# EAGLE design Dash (EAGLE 8.4.1)
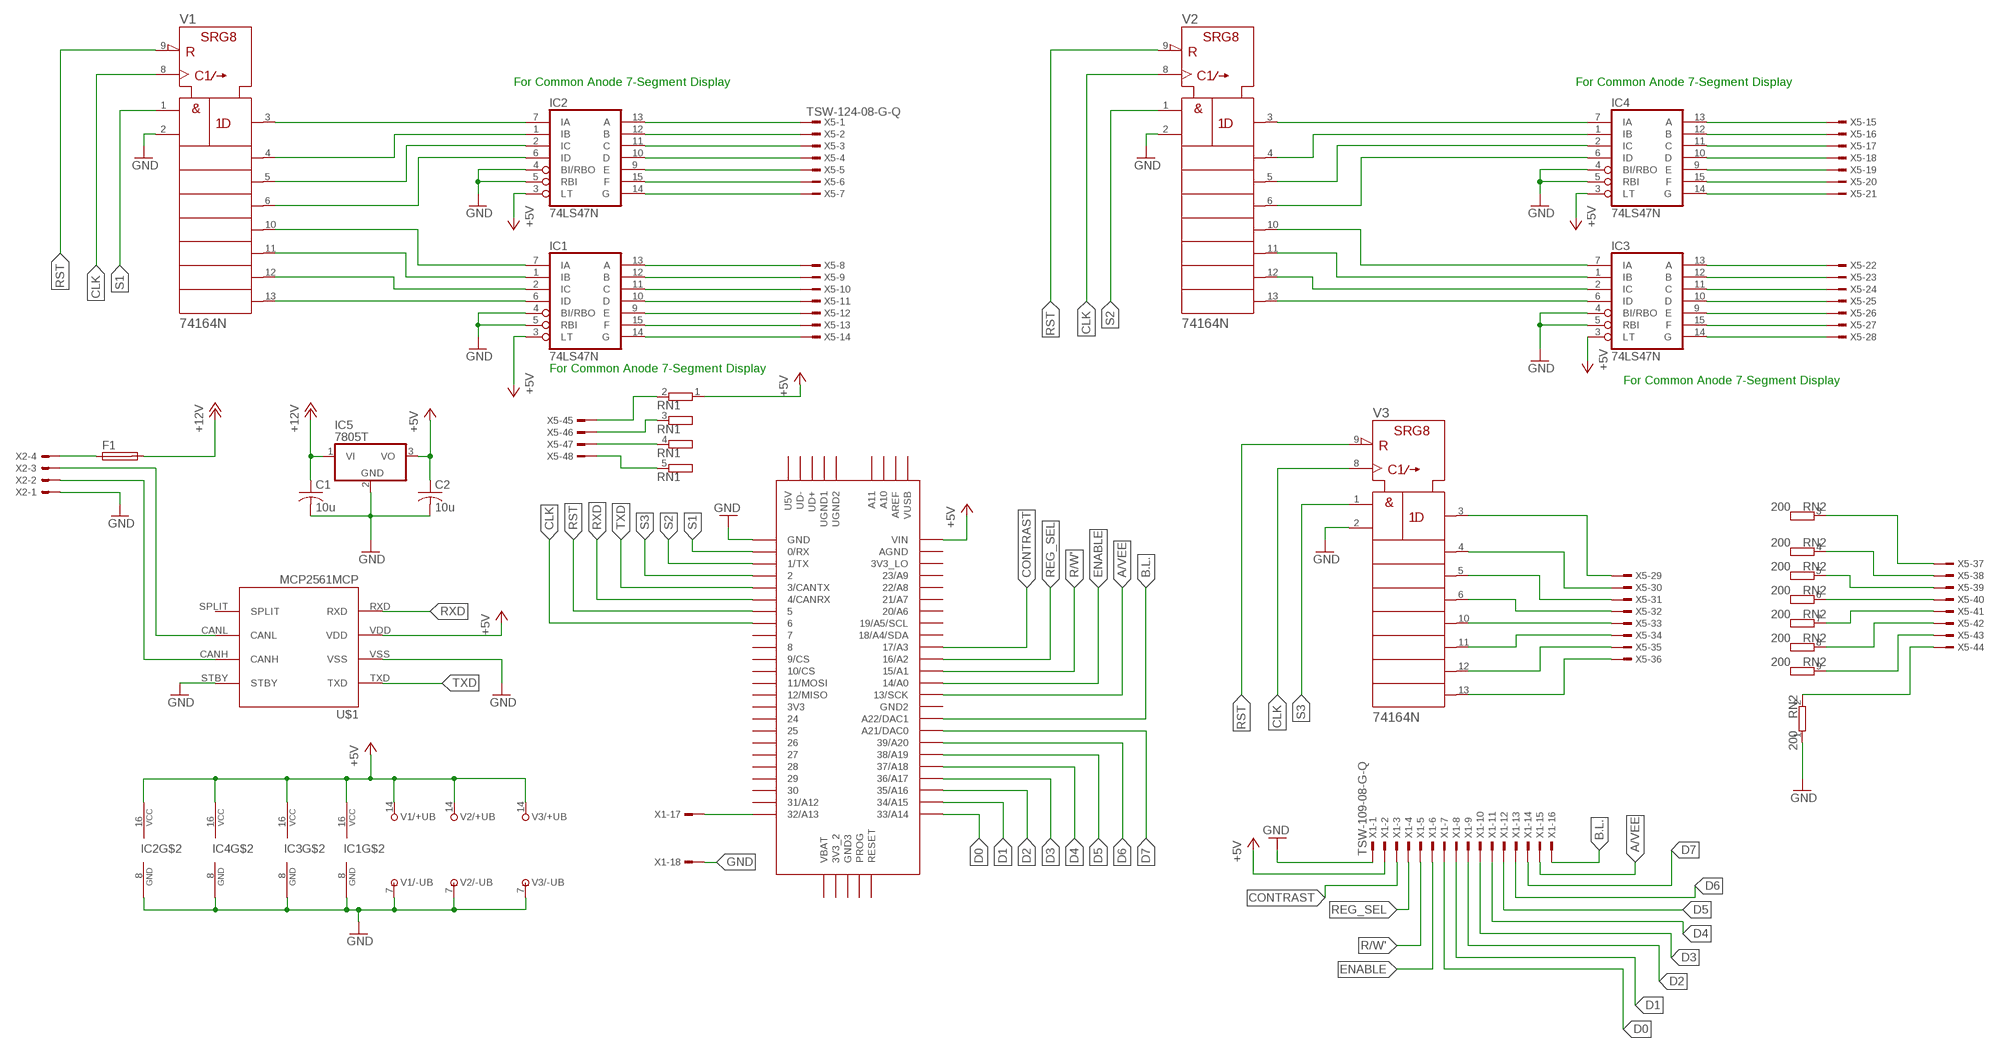
[diagram p0: schematic, sheet 1]

## Parts
C1  10u  C-US050-024X044  [C050-024X044]
C2  10u  C-US050-024X044  [C050-024X044]
F1  FUSEBLANK_5X20MM  [FUSE_HOLDER_5X20MM]
IC1  74LS47N  [DIL16]
IC2  74LS47N  [DIL16]
IC3  74LS47N  [DIL16]
IC4  74LS47N  [DIL16]
IC5  7805T  [TO220H]
RN1  GE04RP  [SIL5]
RN2  200  GE08RP  [SIL9]
U$1  MCP2561MCP  [MCP2561_PDIP]
U$2  TEENSY_3.5/3.6  [TEENSY_3.5/3.6]
V1  74164N  [DIL14]
V2  74164N  [DIL14]
V3  74164N  [DIL14]
X1  TSW-109-08-G-Q  [TSW-109-XX-G-Q]
X2  KK-156-4  [KK-156-4]
X5  TSW-124-08-G-Q  [TSW-124-XX-G-Q]

## Nets
+5V: C2.1 IC1.3(LT) IC1.16(VCC) IC2.3(LT) IC2.16(VCC) IC3.3(LT) IC3.16(VCC) IC4.3(LT) IC4.16(VCC) IC5.3(VO) RN1.1 U$1.VDD U$2.VIN V1.14(+UB) V2.14(+UB) V3.14(+UB) X1.2
+12V: C1.1 F1.2 IC5.1(VI)
A1: IC2.13(A) X5.1
A2: IC1.13(A) X5.8
A3: IC3.13(A) X5.22
A4: IC4.13(A) X5.15
A/VEE: U$2.13/SCK X1.15
B1: IC2.12(B) X5.2
B2: IC1.12(B) X5.9
B3: IC3.12(B) X5.23
B4: IC4.12(B) X5.16
B.L.: U$2.A22/DAC1 X1.16
C1: IC2.11(C) X5.3
C2: IC1.11(C) X5.10
C3: IC3.11(C) X5.24
C4: IC4.11(C) X5.17
CAN_H: U$1.CANH X2.2
CAN_L: U$1.CANL X2.3
CLK: U$2.6 V1.8(CLK) V2.8(CLK) V3.8(CLK)
CONTRAST: U$2.17/A3 X1.3
D0: U$2.33/A14 X1.7
D1: IC2.10(D) U$2.34/A15 X1.8 X5.4
D2: IC1.10(D) U$2.35/A16 X1.9 X5.11
D3: IC3.10(D) U$2.36/A17 X1.10 X5.25
D4: IC4.10(D) U$2.37/A18 X1.11 X5.18
D5: U$2.38/A19 X1.12
D6: U$2.39/A20 X1.13
D7: U$2.21/DAC0(A21/DAC0) X1.14
E1: IC2.9(E) X5.5
E2: IC1.9(E) X5.12
E3: IC3.9(E) X5.26
E4: IC4.9(E) X5.19
ENABLE: U$2.14/A0 X1.6
F1: IC2.15(F) X5.6
F2: IC1.15(F) X5.13
F3: IC3.15(F) X5.27
F4: IC4.15(F) X5.20
G1: IC2.14(G) X5.7
G2: IC1.14(G) X5.14
G3: IC3.14(G) X5.28
G4: IC4.14(G) X5.21
GND: C1.2 C2.2 IC1.4(BI/RBO) IC1.5(RBI) IC1.8(GND) IC2.4(BI/RBO) IC2.5(RBI) IC2.8(GND) IC3.4(BI/RBO) IC3.5(RBI) IC3.8(GND) IC4.4(BI/RBO) IC4.5(RBI) IC4.8(GND) IC5.2(GND) RN2.1 U$1.STBY U$1.VSS U$2.GND V1.2(B) V1.7(-UB) V2.2(B) V2.7(-UB) V3.2(B) V3.7(-UB) X1.1 X1.18 X2.1
N$1: RN2.6 X5.40
N$2: V3.4(QB) X5.30
N$3: V3.5(QC) X5.31
N$4: V3.6(QD) X5.32
N$7: V3.10(QE) X5.33
N$8: V3.11(QF) X5.34
N$9: V3.12(QG) X5.35
N$10: V3.13(QH) X5.36
N$11: RN2.5 X5.39
N$12: RN2.4 X5.38
N$13: RN2.3 X5.37
N$14: RN2.7 X5.41
N$15: RN2.8 X5.42
N$16: RN2.9 X5.43
N$17: RN2.2 X5.44
N$18: U$2.32/A13 X1.17
N$19: F1.1 X2.4
N$20: RN1.2 X5.45
N$21: RN1.3 X5.46
N$22: RN1.4 X5.47
N$23: RN1.5 X5.48
N$31: IC4.7(IA) V2.3(QA)
N$32: IC4.1(IB) V2.4(QB)
N$33: IC4.2(IC) V2.5(QC)
N$34: IC4.6(ID) V2.6(QD)
N$35: IC3.7(IA) V2.10(QE)
N$37: IC3.2(IC) V2.12(QG)
N$38: IC3.6(ID) V2.13(QH)
N$39: IC2.7(IA) V1.3(QA)
N$40: IC2.1(IB) V1.4(QB)
N$41: IC2.2(IC) V1.5(QC)
N$42: IC2.6(ID) V1.6(QD)
N$43: IC1.7(IA) V1.10(QE)
N$44: IC1.1(IB) V1.11(QF)
N$45: IC1.2(IC) V1.12(QG)
N$46: IC1.6(ID) V1.13(QH)
N$47: IC3.1(IB) V2.11(QF)
N$56: V3.3(QA) X5.29
R/W': U$2.15/A1 X1.5
REG_SEL: U$2.16/A2 X1.4
RST: U$2.5 V1.9(!CLR) V2.9(!CLR) V3.9(!CLR)
RXD: U$1.RXD U$2.4/CANRX
S1: U$2.0/RX V1.1(A)
S2: U$2.1/TX V2.1(A)
S3: U$2.2 V3.1(A)
TXD: U$1.TXD U$2.3/CANTX
Unconnected: U$1.SPLIT U$2.3V3 U$2.3V3_2 U$2.3V3_LO U$2.7 U$2.8 U$2.9/CS U$2.10/CS U$2.11/MOSI U$2.12/MISO U$2.18/A4/SDA U$2.19/A5/SCL U$2.20/A6 U$2.21/A7 U$2.22/A8 U$2.23/A9 U$2.24 U$2.25 U$2.26 U$2.27 U$2.28 U$2.29 U$2.30 U$2.31/A12 U$2.A10 U$2.A11 U$2.AGND U$2.AREF U$2.GND2 U$2.GND3 U$2.PROG U$2.RESET U$2.U5V U$2.UD+ U$2.UD- U$2.UGND1 U$2.UGND2 U$2.VBAT U$2.VUSB

## Notes on the sheet
- For Common Anode 7-Segment Display | For Common Anode 7-Segment Display
- For Common Anode 7-Segment Display
- For Common Anode 7-Segment Display

## Library data of the parts
C1 C2 = rcl:C-US: CAPACITOR, American symbol; CAPACITANCE: 10uF
F1 = fuse:FUSE: Fuse; OC_FARNELL: unknown; OC_NEWARK: unknown
IC1-IC4 = 74xx-us:74*47: BCD to seven segment DECODER/DRIVER Source: http://www.ee.washington.edu/stores/DataSheets/74ls/74ls47.pdf
IC5 = linear:78*: Positive VOLTAGE REGULATOR Source: http://cache.national.com/ds/LM/LM78L05.pdf http://www.fairchildsemi.com/ds/LM/LM7805.pdf
RN1 = resistor-sil:GE04RP: SIL RESISTOR; OC_FARNELL: unknown; OC_NEWARK: unknown
RN2 = resistor-sil:GE08RP: SIL RESISTOR; OC_FARNELL: unknown; OC_NEWARK: unknown
U$1 = PoJD:MCP2561: High-Speed CAN Transceiver See http://ww1.microchip.com/downloads/en/DeviceDoc/25167A.pdf The MCP2561/2 is a Microchip Technology Inc. second generation high-speed CAN transceiver. It serves as an interface between a CAN protocol controller and the physical two-wire CAN bus. The device meets the automotive requirements for high-speed (up to 1 Mb/s), low quiescent current, electromagnetic compatibility (EMC) and electrostatic discharge (ESD).
U$2 = Teensy356:TEENSY_3.5/3.6
V1-V3 = 74ttl-din:74*164: 8-bit parallel out SHIFT REGISTER
X1 = con-samtec:TSW-109-*-G: THROUGH-HOLE .025" SQ POST HEADER Source: Samtec TSW.pdf; MF: Samtec Inc.; MPN: TSW-109-07-G-Q
X2 = con-molex:KK-156-4: KK 156 HEADER Source: http://www.molex.com/pdm_docs/sd/026604100_sd.pdf; MF: MOLEX; OC_FARNELL: unknown; OC_NEWARK: unknown
X5 = con-samtec:TSW-124-*-G: THROUGH-HOLE .025" SQ POST HEADER Source: Samtec TSW.pdf; MF: Samtec Inc.; MPN: TSW-124-07-G-Q

## Board
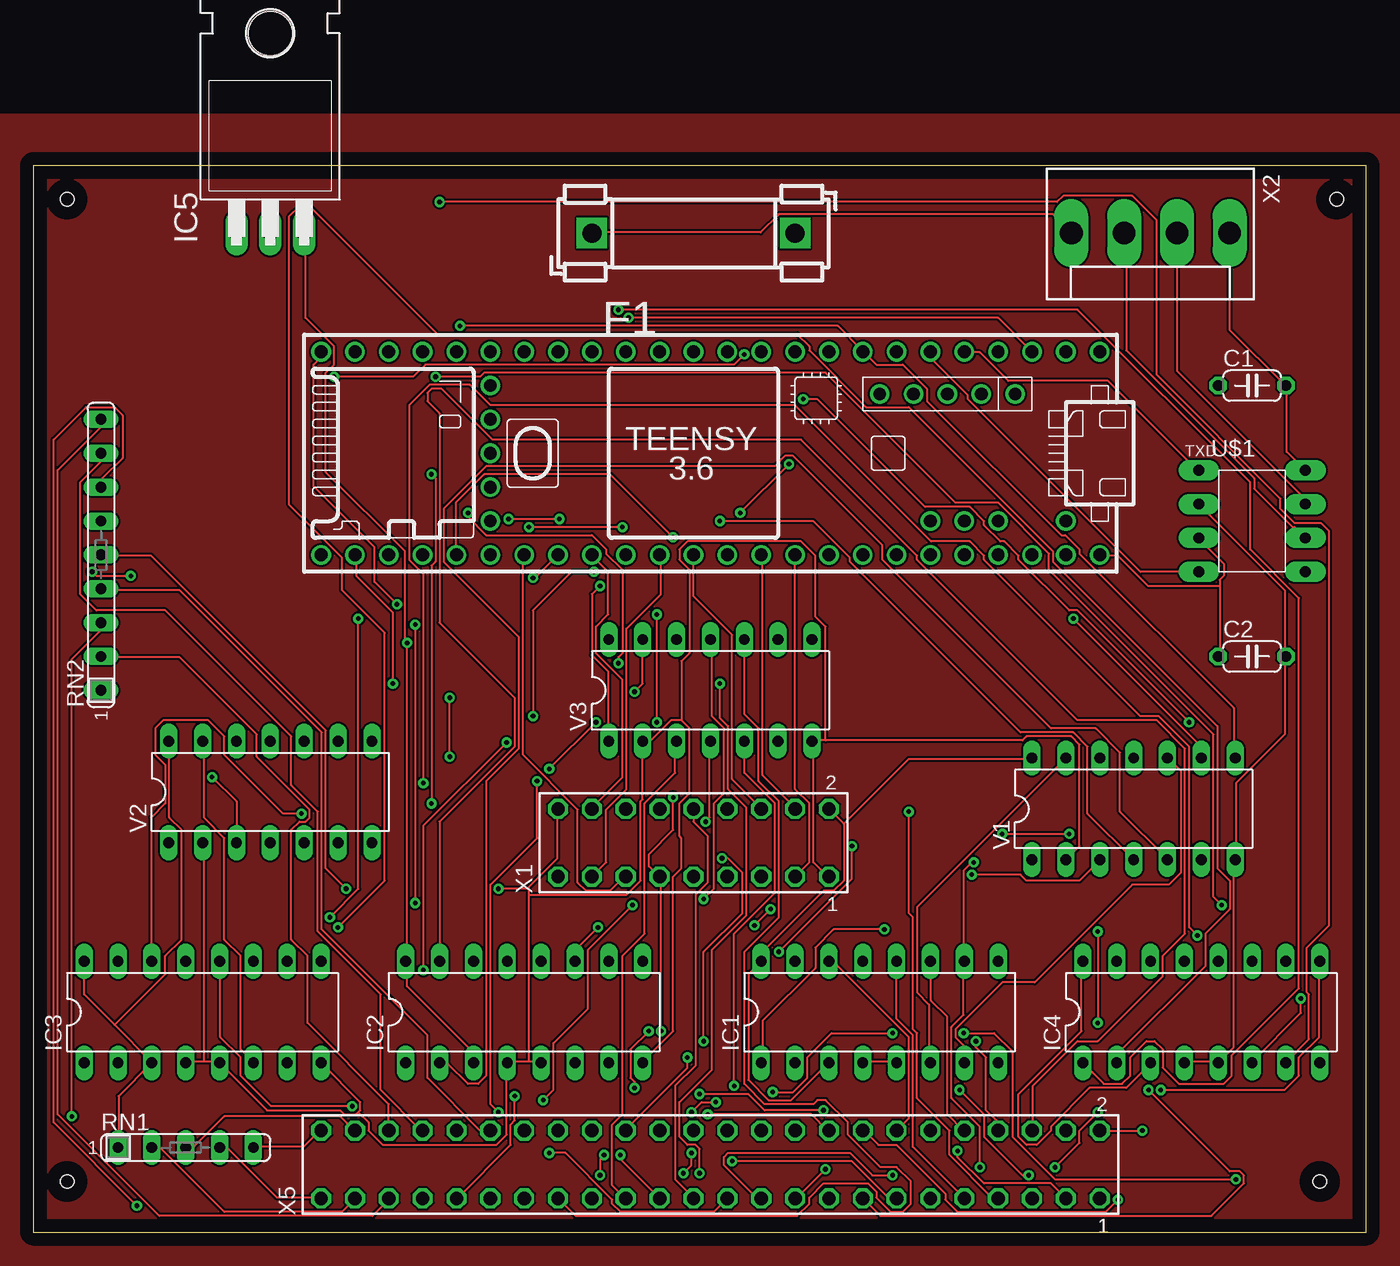
[diagram p1: board, top side]
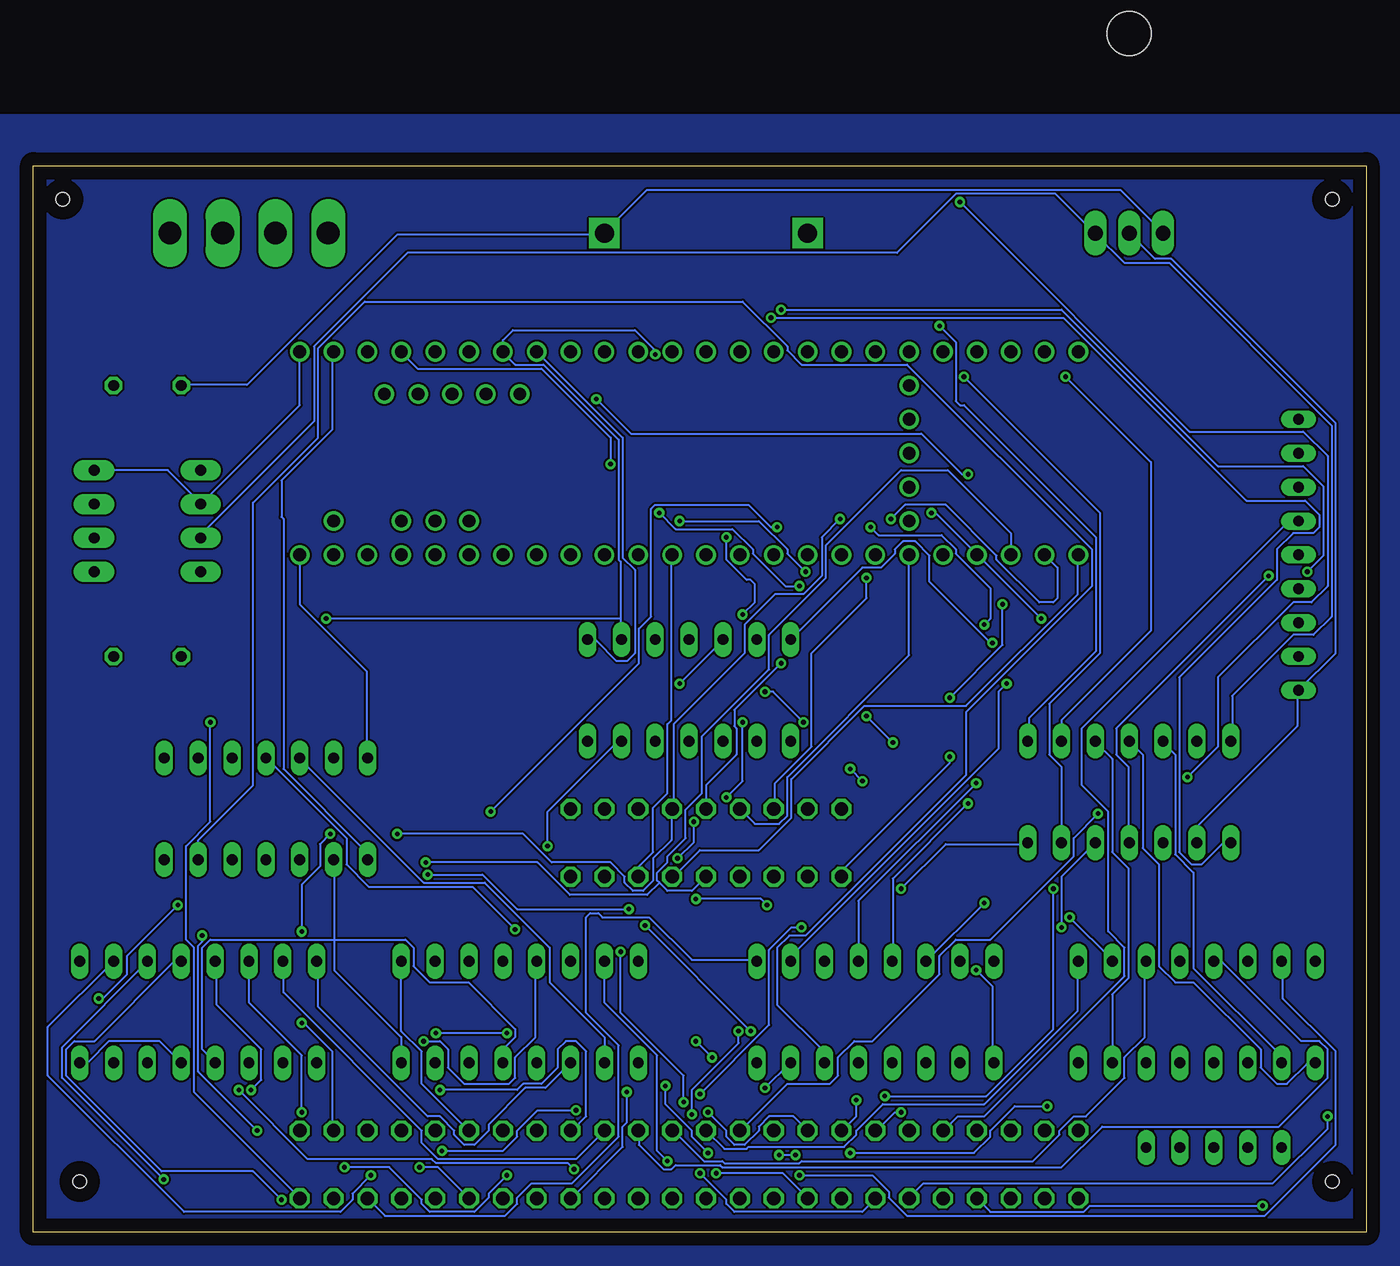
[diagram p2: board, bottom side, seen from below]

Size 100 x 80 mm. Coordinates in mm from the lower left corner, seen from the top.
Outline: 0,0 100,0 100,80 0,80 0,0
Copper layers (1*16): Top 0.035mm / dielectric 1.5mm / Bottom 0.035mm
Design rules "default": minimum track width 6mil, minimum drill 0.35mm, track to track 6mil, track to pad 6mil, pad to pad 6mil, via to via 6mil, smd to smd 6mil, copper to edge 40mil, drill to drill 6mil, minimum pad ring 10mil, minimum via ring 8mil, stop-mask expansion 4mil, vias tented up to drill 0mil, thermal gap 10mil
Holes 1 mm at 2.54,77.47 2.54,3.81 96.52,3.81 97.79,77.47

### Footprints (pad centres in the part's own frame; a part is rotated, then mirrored left to right if it is on the bottom)
C050-024X044 = drill 0.813 octagon: 1 -2.54,0; 2 2.54,0
FUSE_HOLDER_5X20MM = drill 1.422 pad 2.286 square: 1 0,0; 2 15.24,0
DIL16 = drill 0.813 long: 1 -8.89,-3.81; 2 -6.35,-3.81; 3 -3.81,-3.81; 4 -1.27,-3.81; 5 1.27,-3.81; 6 3.81,-3.81; 7 6.35,-3.81; 8 8.89,-3.81; 9 8.89,3.81; 10 6.35,3.81; 11 3.81,3.81; 12 1.27,3.81; 13 -1.27,3.81; 14 -3.81,3.81; 15 -6.35,3.81; 16 -8.89,3.81
TO220H = drill 1.118 long: 1 -2.54,-10.16; 2 0,-10.16; 3 2.54,-10.16 | hole 3.302: 0,4.826
SIL5 = drill 0.813 long: 1 -5.08,0; 2 -2.54,0; 3 0,0; 4 2.54,0; 5 5.08,0
SIL9 = drill 0.813 long: 1 -10.16,0; 2 -7.62,0; 3 -5.08,0; 4 -2.54,0; 5 0,0; 6 2.54,0; 7 5.08,0; 8 7.62,0; 9 10.16,0
MCP2561_PDIP = drill 0.813 pad 1.524 long: CANH 4,1.27; CANL 4,-1.27; RXD -4,-3.81; SPLIT 4,-3.81; STBY 4,3.81; TXD -4,3.81; VDD -4,-1.27; VSS -4,1.27
TEENSY_3.5/3.6 = drill 0.965: 0/RX -25.4,-7.62; 1/TX -22.86,-7.62; 2 -20.32,-7.62; 3/CANTX -17.78,-7.62; 3V3 7.62,-7.62; 3V3_2 17.78,-2.54; 3V3_LO -22.86,7.62; 4/CANRX -15.24,-7.62; 5 -12.7,-7.62; 6 -10.16,-7.62; 7 -7.62,-7.62; 8 -5.08,-7.62; 9/CS -2.54,-7.62; 10/CS 0,-7.62; 11/MOSI 2.54,-7.62; 12/MISO 5.08,-7.62; 13/SCK 5.08,7.62; 14/A0 2.54,7.62; 15/A1 0,7.62; 16/A2 -2.54,7.62; 17/A3 -5.08,7.62; 18/A4/SDA -7.62,7.62; 19/A5/SCL -10.16,7.62; 20/A6 -12.7,7.62; 21/A7 -15.24,7.62; 21/DAC0 12.7,7.62; 22/A8 -17.78,7.62; 23/A9 -20.32,7.62; 24 10.16,-7.62; 25 12.7,-7.62; 26 15.24,-7.62; 27 17.78,-7.62; 28 20.32,-7.62; 29 22.86,-7.62; 30 25.4,-7.62; 31/A12 27.94,-7.62; 32/A13 30.48,-7.62; 33/A14 30.48,7.62; 34/A15 27.94,7.62; 35/A16 25.4,7.62; 36/A17 22.86,7.62; 37/A18 20.32,7.62; 38/A19 17.78,7.62; 39/A20 15.24,7.62; A10 -17.78,5.08; A11 -15.24,5.08; A22/DAC1 10.16,7.62; AGND -25.4,7.62; AREF -20.32,5.08; GND -27.94,-7.62; GND2 7.62,7.62; GND3 17.78,0; PROG 17.78,2.54; RESET 17.78,5.08; U5V -21.59,-4.445; UD+ -16.51,-4.445; UD- -19.05,-4.445; UGND1 -13.97,-4.445; UGND2 -11.43,-4.445; VBAT 17.78,-5.08; VIN -27.94,7.62; VUSB -25.4,5.08
DIL14 = drill 0.813 long: 1 -7.62,-3.81; 2 -5.08,-3.81; 3 -2.54,-3.81; 4 0,-3.81; 5 2.54,-3.81; 6 5.08,-3.81; 7 7.62,-3.81; 8 7.62,3.81; 9 5.08,3.81; 10 2.54,3.81; 11 0,3.81; 12 -2.54,3.81; 13 -5.08,3.81; 14 -7.62,3.81
TSW-109-XX-G-Q = drill 1 pad 1.5 octagon: 1 10.16,-2.54; 2 10.16,2.54; 3 7.62,-2.54; 4 7.62,2.54; 5 5.08,-2.54; 6 5.08,2.54; 7 2.54,-2.54; 8 2.54,2.54; 9 0,-2.54; 10 0,2.54; 11 -2.54,-2.54; 12 -2.54,2.54; 13 -5.08,-2.54; 14 -5.08,2.54; 15 -7.62,-2.54; 16 -7.62,2.54; 17 -10.16,-2.54; 18 -10.16,2.54
KK-156-4 = drill 1.7 pad 2.184 long: 1 -5.94,0; 2 -1.98,0; 3 1.98,0; 4 5.94,0
TSW-124-XX-G-Q = drill 1 pad 1.5 octagon: 1 29.21,-2.54; 2 29.21,2.54; 3 26.67,-2.54; 4 26.67,2.54; 5 24.13,-2.54; 6 24.13,2.54; 7 21.59,-2.54; 8 21.59,2.54; 9 19.05,-2.54; 10 19.05,2.54; 11 16.51,-2.54; 12 16.51,2.54; 13 13.97,-2.54; 14 13.97,2.54; 15 11.43,-2.54; 16 11.43,2.54; 17 8.89,-2.54; 18 8.89,2.54; 19 6.35,-2.54; 20 6.35,2.54; 21 3.81,-2.54; 22 3.81,2.54; 23 1.27,-2.54; 24 1.27,2.54; 25 -1.27,-2.54; 26 -1.27,2.54; 27 -3.81,-2.54; 28 -3.81,2.54; 29 -6.35,-2.54; 30 -6.35,2.54; 31 -8.89,-2.54; 32 -8.89,2.54; 33 -11.43,-2.54; 34 -11.43,2.54; 35 -13.97,-2.54; 36 -13.97,2.54; 37 -16.51,-2.54; 38 -16.51,2.54; 39 -19.05,-2.54; 40 -19.05,2.54; 41 -21.59,-2.54; 42 -21.59,2.54; 43 -24.13,-2.54; 44 -24.13,2.54; 45 -26.67,-2.54; 46 -26.67,2.54; 47 -29.21,-2.54; 48 -29.21,2.54

### Placement (x,y rotation side)
C1  91.44,63.5 0 top
C2  91.44,43.18 0 top
F1  41.91,74.93 0 top
IC1  63.5,16.51 0 top
IC2  36.83,16.51 0 top
IC3  12.7,16.51 0 top
IC4  87.63,16.51 0 top
IC5  17.78,85.09 0 top
RN1  11.43,6.35 0 top
RN2  5.08,50.8 90 top
U$1  91.44,53.34 0 top
U$2  52.07,58.42 180 top
V1  82.55,31.75 0 top
V2  17.78,33.02 0 top
V3  50.8,40.64 0 top
X1  49.53,29.21 0 top
X2  83.82,74.93 180 top
X5  50.8,5.08 0 top

### Tracks (layer width: path | path; a pad name or v marks a point on that pad's centre or on a via)
+5V  (via drill 0.35)
  Top 0.152: IC2.3 32.92,12.8 32.92,13.56 28.04,18.44 28.04,20.27 IC2.16 28.04,20.42 v28.04,44.2 27.89,44.35 27.89,51.05 21.95,57 21.95,64.47 22.55,65.08 22.55,66.45 20.42,68.58 20.42,74.83 IC5.3 | IC4.16 78.64,20.27 78.64,15.09 73.91,10.36 73.91,7.16 74.52,6.55 75.29,6.55 76.35,7.62 76.35,7.92 79.25,10.82 81.99,10.82 83.82,12.65 IC4.3 | 60.81,30.63 60.81,26.36 60.05,25.6 59.28,25.6 54.71,21.03 54.71,20.42 IC1.16 53.65,19.36 53.65,11.43 55.17,9.91 56.84,9.91 59.59,12.65 IC1.3 | X1.2 60.81,30.63 | 60.81,30.63 65.68,35.51 74.83,35.51 V1.14 | 89,48.46 89,48.92 89.31,49.23 89.31,50.14 87.48,51.97 U$1.VDD | 89,48.46 89,43.28 C2.1 | 89,48.46 83.67,48.46 81.38,50.75 80.01,50.75 U$2.VIN | RN1.1 6.4,6.4 6.4,10.21 IC3.3 8.84,12.8 6.1,15.54 | IC3.16 3.81,17.83 6.1,15.54 | 6.1,15.54 9.91,19.36 9.91,20.73 11.12,21.95 11.12,30.18 10.21,31.09 10.21,36.73 V2.14
  Bottom 0.152: IC1.3 61.57,10.82 63.09,10.82 65.84,8.08 65.84,7.62 66.9,6.55 67.67,6.55 68.43,7.32 68.43,7.62 69.49,8.69 70.41,8.69 78.64,16.92 78.64,20.27 IC4.16 | U$2.VIN 80.01,47.09 74.98,42.06 74.98,35.66 V1.14 | V3.14 37.8,49.84 36.42,49.84 35.36,50.9 35.36,51.21 34.75,51.82 33.83,51.82 32.77,50.75 32.77,48.77 28.19,44.2 v28.04,44.2 | V2.14 10.06,36.88 10.06,40.23 5.49,44.81 3.96,44.81 2.59,46.18 2.59,60.5 14.78,72.69 18.14,72.69 20.27,74.83 IC5.3 20.42,74.98 23.32,77.88 30.79,77.88 35.2,73.46 71.93,73.46 78.94,66.45 78.94,60.81 87.33,52.43 87.33,52.12 U$1.VDD
+12V
  Bottom 0.152: C1.1 88.85,63.55 83.97,63.55 72.69,74.83 57.15,74.83 F1.2 57.15,74.98 53.95,78.18 18.44,78.18 15.24,74.98 IC5.1
A1  (via drill 0.35)
  Top 0.152: v29.87,32.16 29.87,49.99 30.18,50.29 30.18,56.54 v29.87,56.84 | v57.76,62.48 58.83,62.48 66.9,54.41 70.26,54.41 71.32,53.34 71.32,53.03 72.54,51.82 72.85,51.82 73.91,50.75 73.91,50.44 77.72,46.63 78.33,46.63 v86.72,38.25
  Bottom 0.152: v29.87,32.16 35.51,26.52 35.51,20.42 IC2.13 | v29.87,56.84 30.33,56.84 33.38,59.89 55.17,59.89 v57.76,62.48 | v86.72,38.25 86.72,30.79 88.54,28.96 88.54,21.95 87.94,21.34 87.94,10.52 80.01,2.59 X5.1
A2  (via drill 0.35)
  Top 0.152: v70.71,14.33 70.71,13.87 71.48,13.11 71.48,9.14 72.39,8.23 X5.8
  Bottom 0.152: v70.71,14.33 69.49,14.33 68.89,13.72 68.89,12.34 67.67,11.12 64.31,11.12 63.86,11.58 63.86,13.11 62.33,14.63 62.33,20.27 IC1.13
A3
  Bottom 0.152: IC3.13 11.43,20.27 10.82,20.27 4.88,14.33 3.5,14.33 2.9,13.72 2.9,11.58 6.55,7.92 19.81,7.92 22.86,4.88 48.31,4.88 48.46,5.03 51.82,5.03 52.12,4.72 52.73,4.72 54.56,6.55 54.56,7.62 X5.22
A4  (via drill 0.35)
  Top 0.152: v83.67,10.67 89.76,4.57 90.53,4.57 90.83,4.27 90.83,3.66 88.39,1.22 63.55,1.22 X5.15
  Bottom 0.152: v83.67,10.67 82.91,11.43 82.91,13.72 86.26,17.07 86.26,20.27 IC4.13
A/VEE
  Top 0.152: X1.15 42.98,27.74 42.98,31.7 44.5,33.22 44.5,45.26 47.09,47.85 47.09,50.75 U$2.13/SCK
B1  (via drill 0.35)
  Top 0.152: v29.26,33.68 29.26,49.38 28.19,50.44 28.19,62.03 29.72,63.55 32.77,63.55 34.29,62.03 57.15,62.03 67.36,51.82 70.26,51.82 71.32,50.75 71.32,50.44 83.06,38.71 84.43,38.71 86.72,36.42 86.72,22.86 v87.33,22.25 | X5.2 v83.21,7.62
  Bottom 0.152: IC2.12 38.1,24.84 v29.26,33.68 | v87.33,22.25 87.33,21.79 87.63,21.49 87.63,12.04 v83.21,7.62
B2
  Top 0.152: IC1.12 64.77,16 65.99,14.78 65.99,6.4 X5.9
B3  (via drill 0.35)
  Top 0.152: v23.93,9.45 17.83,9.45 15.54,11.73 15.54,13.11 14.02,14.63 14.02,20.27 IC3.12 | v38.71,5.94 39.93,5.94 43.43,2.44 43.43,2.13 44.04,1.52 51.05,1.52 X5.23
  Bottom 0.152: v23.93,9.45 26.36,9.45 28.19,7.62 28.19,7.16 29.41,5.94 v38.71,5.94
B4  (via drill 0.35)
  Top 0.152: v81.38,2.44 80.47,1.52 69.34,1.52 68.43,2.44 68.43,2.9 64.77,6.55 63.4,6.55 62.33,7.62 X5.16
  Bottom 0.152: v81.38,2.44 83.52,4.57 90.37,4.57 97.54,11.73 97.54,13.72 96.93,14.33 95.4,14.33 89.46,20.27 89,20.27 IC4.12
B.L.
  Top 0.152: U$2.A22/DAC1 41.91,50.75 43.13,49.53 43.13,46.33 42.22,45.41 42.22,43.43 44.2,41.45 44.2,34.14 41.91,31.85 X1.16
C1  (via drill 0.35)
  Top 0.152: v42.37,22.86 40.69,21.18 40.69,20.42 IC2.11 | v49.99,10.36 53.65,10.36 54.86,9.14 v59.28,9.14 | v69.34,6.1 69.34,5.64 71.32,3.66 76.35,3.66 X5.3
  Bottom 0.152: v42.37,22.86 43.13,22.86 44.81,21.18 44.81,15.54 v49.99,10.36 | v59.28,9.14 62.18,9.14 63.7,7.62 63.7,7.16 64.77,6.1 v69.34,6.1
C2
  Top 0.152: IC1.11 67.36,20.27 67.36,17.37 68.58,16.15 68.58,8.84 69.8,7.62 X5.10
C3
  Bottom 0.152: IC3.11 16.61,20.27 16.61,14.63 18.14,13.11 18.14,11.58 21.03,8.69 21.95,8.69 23.01,7.62 23.01,7.32 24.99,5.33 42.37,5.33 42.52,5.18 48.16,5.18 48.31,5.33 49.68,5.33 51.97,7.62 X5.24
C4  (via drill 0.35)
  Top 0.152: v90.22,3.96 76.66,3.96 73.46,7.16 73.46,13.56 72.08,14.94 v69.8,14.94 | v64.47,14.94 59.89,14.94 58.06,13.11 58.06,11.58 57,10.52 v55.47,10.52
  Bottom 0.152: v90.22,3.96 97.84,11.58 97.84,13.87 91.44,20.27 IC4.11 | v64.47,14.94 v69.8,14.94 | v55.47,10.52 55.47,8.23 55.78,7.92 55.78,6.4 59.59,2.59 X5.17
CAN_H
  Top 0.152: U$1.CANH 95.4,54.71 95.4,55.02 85.8,64.62 85.8,74.83 X2.2
CAN_L
  Top 0.152: U$1.CANL 95.4,52.12 94.64,52.88 94.49,52.88 91.59,55.78 91.59,56.54 81.99,66.14 81.99,74.83 X2.3
CLK  (via drill 0.35)
  Top 0.152: v32,67.97 60.35,67.97 62.18,66.14 U$2.6 62.33,65.99 63.25,65.08 65.23,65.08 67.06,63.25 67.06,62.33 77.11,52.27 77.42,52.27 78.49,51.21 78.49,50.9 90.07,39.32 90.07,35.66 V1.8
  Bottom 0.152: v32,67.97 30.79,66.75 30.79,62.33 30.48,62.03 30.18,62.03 20.27,52.12 20.27,43.59 25.3,38.56 25.3,36.88 V2.8 | U$2.6 55.78,59.59 55.78,50.6 54.86,49.68 54.86,43.43 55.47,42.82 56.24,42.82 57.76,44.35 58.37,44.35 V3.8
CONTRAST
  Top 0.152: U$2.17/A3 57.15,33.22 58.22,32.16 58.22,27.74 X1.3
D0
  Bottom 0.152: U$2.33/A14 21.64,50.75 21.64,47.85 30.02,39.47 37.64,39.47 43.13,33.98 43.13,31.09 45.57,28.65 49.99,28.65 51.97,26.67 X1.7
D1  (via drill 0.35)
  Top 0.152: v26.98,41.15 26.98,46.48 24.23,49.23 24.23,50.75 U$2.34/A15 | v35.66,53.49 v39.47,53.49 | v79.86,22.55 v79.86,15.7 | v72.69,29.87 v77.72,29.87
  Bottom 0.152: v26.98,41.15 27.58,40.54 27.58,36.27 43.13,20.73 43.13,20.42 IC2.10 | v39.47,53.49 40.84,52.12 40.84,49.23 42.22,47.85 44.35,47.85 46.63,45.57 46.63,43.43 51.97,38.1 51.97,31.85 X1.8 52.12,31.7 52.12,29.41 53.49,28.04 53.49,26.36 54.25,25.6 55.02,25.6 55.63,26.21 55.63,26.67 56.69,27.74 61.11,27.74 63.25,29.87 v72.69,29.87 | v35.66,53.49 34.59,54.56 31.55,54.56 27.74,50.75 27.74,50.44 24.54,47.24 23.47,47.24 23.16,47.55 23.16,49.84 U$2.34/A15 | v79.86,15.7 79.7,15.7 77.57,13.56 77.57,7.62 X5.4 | v79.86,22.55 79.86,26.06 78.49,27.43 78.49,29.11 v77.72,29.87
D2  (via drill 0.35)
  Top 0.152: v71.02,4.88 71.02,7.92 68.89,10.06 68.89,15.39 69.8,16.31 69.8,20.27 IC1.10 69.8,20.42 69.8,27.13 70.41,27.74 v70.56,27.74
  Bottom 0.152: v71.02,4.88 69.65,4.88 X5.11 | U$2.35/A16 26.67,52.43 31.39,57.15 34.9,57.15 40.54,51.51 40.54,49.07 44.81,44.81 44.81,42.22 49.84,37.19 49.84,32.92 51.05,31.7 51.05,29.57 52.43,28.19 52.43,27.74 53.19,26.98 53.19,26.36 53.03,26.21 | 53.03,26.21 52.43,25.6 50.6,25.6 X1.9 | v70.56,27.74 62.18,27.74 59.74,25.3 53.95,25.3 53.03,26.21
D3  (via drill 0.35)
  Top 0.152: v24.38,46.02 24.38,25.76 v22.25,23.62 | v43.89,42.67 43.89,43.13 44.2,43.43 44.2,49.68 42.98,50.9 42.98,51.21 41.91,52.27 33.98,52.27 32.61,53.65 v32.61,53.95 | X1.10 49.53,30.79 50.6,29.72 50.6,26.21 49.68,25.3 49.68,12.5 48.16,10.97 48.16,3.96 49.53,2.59 X5.25
  Bottom 0.152: v24.38,46.02 29.11,50.75 U$2.36/A17 29.26,50.9 32.31,53.95 v32.61,53.95 | v22.25,23.62 19.05,20.42 IC3.10 | X1.10 49.53,33.53 47.24,35.81 47.24,37.8 47.4,37.95 47.4,39.17 v43.89,42.67
D4  (via drill 0.35)
  Top 0.152: v48.01,52.12 43.28,56.84 33.83,56.84 31.7,54.71 31.7,50.9 U$2.37/A18 | v46.79,38.25 v46.79,46.33 | v48.01,32.61 48.01,30.18 46.18,28.35 46.18,27.43 46.94,26.67 X1.11 47.09,26.67 v47.09,15.09 | v74.68,4.27 74.22,4.27 71.32,7.16 71.32,8.84 v69.49,10.67 | v50.6,8.84 58.37,8.84 59.59,7.62 X5.18
  Bottom 0.152: v48.01,52.12 48.01,50.44 46.48,48.92 46.18,48.92 45.87,48.62 45.87,47.24 v46.79,46.33 | v46.79,38.25 46.79,33.83 v48.01,32.61 | IC4.10 98.91,15.39 98.91,11.73 88.7,1.52 76.96,1.52 76.05,2.44 76.05,2.9 v74.68,4.27 | v69.49,10.67 63.7,10.67 63.25,11.12 61.87,11.12 60.66,12.34 60.66,13.72 60.05,14.33 59.28,14.33 58.52,13.56 58.52,8.69 59.59,7.62 X5.18 | v47.09,15.09 47.09,14.17 50.6,10.67 v50.6,8.84
D5
  Bottom 0.152: U$2.38/A19 34.29,43.28 43.43,34.14 43.43,31.24 44.04,30.63 45.87,30.63 X1.12
D6
  Top 0.152: U$2.39/A20 36.73,50.75 36.73,35.81 40.84,31.7 40.84,26.21 41.45,25.6 43.28,25.6 44.35,26.67 X1.13
D7  (via drill 0.35)
  Top 0.152: U$2.21/DAC0 37.64,49.07 v37.49,49.07
  Bottom 0.152: v37.49,49.07 37.49,47.55 41.6,43.43 41.6,36.42 44.35,33.68 44.35,31.85 X1.14
E1
  Bottom 0.152: X5.5 73.61,1.22 64.62,1.22 63.7,2.13 63.7,2.59 62.64,3.66 59.59,3.66 56.08,7.16 56.08,14.02 58.52,16.46 58.52,23.62 58.22,23.93 57.61,23.93 57.3,23.62 53.8,23.62 50.6,20.42 45.72,20.42 IC2.9
E2
  Bottom 0.152: IC1.9 72.39,15.09 70.87,13.56 70.87,11.12 67.36,7.62 X5.12
E3
  Bottom 0.152: X5.26 48.16,6.25 46.48,6.25 46.33,6.4 39.17,6.4 38.25,7.32 38.25,7.62 36.27,9.6 28.65,9.6 21.64,16.61 21.64,20.27 IC3.9
E4  (via drill 0.35)
  Top 0.152: v84.58,10.67 93.88,10.67 94.94,11.73 94.94,13.11 96.47,14.63 96.47,20.27 IC4.9 | v59.44,4.72 57.15,2.44 X5.19
  Bottom 0.152: v84.58,10.67 79.4,5.49 70.1,5.49 69.8,5.18 59.89,5.18 v59.44,4.72
ENABLE
  Top 0.152: U$2.14/A0 49.53,47.7 52.43,44.81 52.43,33.98 54.56,31.85 X1.6
F1
  Top 0.152: IC2.15 30.48,30.79 36.12,36.42 36.12,40.08 30.48,45.72 30.48,61.42 29.57,62.33 29.57,62.94 29.87,63.25 30.63,63.25 34.44,59.44 57.61,59.44 66.29,50.75 66.29,50.44 78.33,38.41 84.28,38.41 86.41,36.27 86.41,22.4 84.73,20.73 84.73,19.2 79.86,14.33 78.33,14.33 74.98,10.97 74.98,7.62 X5.6
F2  (via drill 0.35)
  Top 0.152: v52.43,5.33 61.42,5.33 64.16,2.59 64.77,2.59 X5.13
  Bottom 0.152: IC1.15 57.15,17.22 53.19,13.26 53.19,6.1 v52.43,5.33
F3  (via drill 0.35)
  Top 0.152: v42.52,4.27 42.52,5.49 v42.82,5.79 | v44.04,5.79 44.04,5.49 X5.27
  Bottom 0.152: v42.52,4.27 37.03,4.27 35.81,3.05 35.81,2.59 34.44,1.22 7.62,1.22 2.29,6.55 2.29,13.56 6.25,17.53 6.25,20.27 IC3.15 | v44.04,5.79 v42.82,5.79
F4
  Bottom 0.152: X5.20 59.28,5.49 69.65,5.49 70.87,6.71 70.87,7.62 81.23,17.98 81.23,20.27 IC4.15
G1  (via drill 0.35)
  Top 0.152: v28.65,45.57 v28.65,24.69 | v44.2,52.88 v37.19,52.88 | v65.68,31.55 65.68,23.93 65.99,23.62 65.99,15.24 66.29,14.94 66.29,10.06 68.73,7.62 68.73,5.79 71.93,2.59 72.39,2.59 X5.7
  Bottom 0.152: v28.65,24.69 IC2.14 | v28.65,45.57 28.19,46.02 28.19,48.31 30.79,50.9 30.79,51.21 31.85,52.27 36.58,52.27 v37.19,52.88 | v44.2,52.88 44.65,52.88 46.33,54.56 53.34,54.56 53.65,54.25 53.65,46.18 54.56,45.26 54.56,42.67 v65.68,31.55
G2
  Top 0.152: X5.14 65.68,8.53 65.68,14.63 60.05,20.27 59.74,20.27 IC1.14
G3  (via drill 0.35)
  Top 0.152: v20.12,31.39 18.75,31.39 14.33,35.81 14.33,37.19 13.11,38.41 9.75,38.41 9.14,37.8 9.14,35.81 9.91,35.05 9.91,32.16 8.84,31.09 8.84,20.42 IC3.14
  Bottom 0.152: v20.12,31.39 21.95,29.57 21.95,28.19 28.19,21.95 30.79,21.95 32,20.73 32,19.36 37.03,14.33 38.41,14.33 39.62,13.11 39.62,11.73 40.23,11.12 43.43,11.12 46.94,7.62 X5.28
G4  (via drill 0.35)
  Top 0.152: v79.86,8.99 78.49,7.62 78.49,6.71 v76.66,4.88 | v64.47,4.27 62.94,4.27 61.27,5.94 52.12,5.94 51.82,5.64 51.82,5.03 54.25,2.59 54.56,2.59 X5.21
  Bottom 0.152: IC4.14 83.82,17.22 79.86,13.26 v79.86,8.99 | v76.66,4.88 73.3,4.88 70.87,2.44 70.87,2.13 70.26,1.52 66.9,1.52 65.84,2.59 65.84,2.9 v64.47,4.27
GND  (via drill 0.35)
  Top 0.152: 37.19,12.8 38.1,12.8 IC2.5 | 37.19,12.8 35.66,12.8 IC2.4 35.51,12.65 35.51,7.32 34.75,6.55 26.21,6.55 25.15,7.62 25.15,8.23 24.38,8.99 | 48.62,38.41 47.85,38.41 46.33,36.88 45.72,36.88 V3.2 45.72,32.46 45.57,32.31 45.57,26.36 44.5,25.3 37.19,25.3 | 48.62,38.41 49.23,37.8 49.23,32.92 48.46,32.16 48.46,29.72 48.62,29.57 48.62,27.28 48.01,26.67 48.01,15.09 45.72,12.8 IC2.8 | 37.19,12.8 37.19,25.3 | 37.19,25.3 37.19,25.76 | 37.19,25.76 37.19,25.91 39.32,28.04 39.32,31.7 X1.18 | X1.1 59.59,26.67 58.52,27.74 58.52,36.73 V3.7 58.52,36.88 59.44,36.88 | IC1.4 62.33,12.8 64.77,12.8 IC1.5 | 59.44,36.88 74.22,36.88 74.52,37.19 77.88,37.19 78.49,36.58 78.49,28.96 V1.2 | IC4.4 86.41,12.8 88.85,12.8 IC4.5 90.07,13.87 90.07,27.89 V1.7 90.22,28.04 90.22,33.68 93.88,37.34 93.88,43.13 C2.2 93.88,43.28 93.88,48.16 87.48,54.56 U$1.VSS | U$1.STBY 95.4,57.15 94.03,58.52 94.03,63.4 C1.2 93.88,63.55 89.76,67.67 89.76,74.83 X2.1 | 48.62,38.41 48.62,42.82 49.23,43.43 49.23,49.68 48.46,50.44 48.46,51.21 49.07,51.82 57.61,51.82 58.67,50.75 58.67,46.18 59.44,45.41 59.44,36.88 | 37.19,25.76 v34.9,25.76 | 12.8,12.8 13.87,12.8 IC3.5 17.53,9.14 23.01,9.14 23.32,8.84 24.23,8.84 24.38,8.99 | 12.8,12.8 11.43,12.8 IC3.4 | IC3.8 24.54,9.75 24.54,9.14 24.38,8.99 | 12.8,12.8 12.8,29.11 V2.2
  Bottom 0.152: V2.2 12.65,29.26 12.65,30.48 5.18,37.95 5.18,40.54 RN2.1 2.29,43.43 2.29,60.66 14.63,73 15.85,73 IC5.2 | IC1.8 72.39,14.63 77.42,19.66 77.42,21.95 | 77.42,21.95 77.42,27.89 V1.2 | IC1.5 64.77,13.72 63.86,14.63 63.86,15.24 67.36,18.75 70.26,18.75 71.48,19.96 71.48,21.34 72.08,21.95 77.42,21.95 | IC4.5 90.53,14.33 94.34,14.33 95.86,12.8 96.47,12.8 IC4.8 | U$2.GND 80.01,62.03 87.33,54.71 U$1.VSS 87.48,54.71 89.92,57.15 U$1.STBY | 77.42,21.95 86.72,21.95 87.33,21.34 87.33,13.72 86.41,12.8 IC4.4 | v34.9,25.76 31.55,29.11 25.45,29.11 V2.7
N$1
  Bottom 0.152: RN2.6 5.79,53.34 21.34,37.8 21.34,33.53 19.36,31.55 19.36,22.55 18.14,21.34 18.14,19.2 28.65,8.69 30.63,8.69 31.7,7.62 X5.40
N$2  (via drill 0.35)
  Top 0.152: v50.44,30.79 50.75,31.09 50.75,36.73 V3.4 | v51.66,28.04 52.12,28.04 53.19,26.98 53.19,23.93 50.29,21.03 v50.29,14.33 | v49.07,13.11 49.07,12.34 44.35,7.62 X5.30
  Bottom 0.152: v50.44,30.79 50.44,29.26 v51.66,28.04 | v49.07,13.11 v50.29,14.33
N$3  (via drill 0.35)
  Top 0.152: V3.5 53.34,34.44 55.63,32.16 55.63,25.45 52.58,22.4 v52.58,10.97 | v49.38,5.94 49.38,5.03 v48.77,4.42
  Bottom 0.152: v52.58,10.97 52.58,9.6 50.6,7.62 50.6,7.16 v49.38,5.94 | v48.77,4.42 43.74,4.42 41.91,2.59 X5.31
N$4  (via drill 0.35)
  Top 0.152: v61.42,28.96 61.42,26.52 v55.93,21.03 | v51.21,9.75 50.14,9.75 v49.38,8.99
  Bottom 0.152: v61.42,28.96 61.42,31.55 56.24,36.73 55.93,36.73 V3.6 | v55.93,21.03 55.93,16.46 51.21,11.73 v51.21,9.75 | v49.38,8.99 48.01,7.62 48.01,7.16 47.4,6.55 46.63,6.55 45.57,7.62 45.57,7.92 44.81,8.69 42.98,8.69 X5.32
N$5
  pour Top: -5.08,83.82 -5.08,-3.81 104.14,-3.81 104.14,85.09 102.87,83.82
N$6
  pour Bottom: -6.35,83.82 -7.62,82.55 -7.62,-3.81 104.14,-3.81 104.14,83.82
N$7
  Top 0.152: V3.10 53.34,38.86 54.41,37.8 54.41,33.83 55.93,32.31 55.93,23.62 53.34,21.03 53.34,11.12 54.86,9.6 58.52,9.6 58.83,9.91 59.44,9.91 61.11,8.23 61.11,7.32 63.55,4.88 64.77,4.88 65.84,3.81 65.84,2.13 65.23,1.52 64.31,1.52 63.25,2.59 63.25,3.05 62.64,3.66 59.28,3.66 58.22,2.59 58.22,2.13 57.3,1.22 40.69,1.22 X5.33
N$8  (via drill 0.35)
  Top 0.152: v50.29,24.99 51.05,25.76 51.05,32.16 51.82,32.92 51.82,37.8 50.9,38.71 50.9,44.35 V3.11 | v44.96,24.54 41.6,21.18 41.6,16.76 39.01,14.17 39.01,10.67 v38.25,9.91
  Bottom 0.152: v50.29,24.99 45.41,24.99 v44.96,24.54 | v38.25,9.91 38.25,8.69 39.32,7.62 X5.34
N$9  (via drill 0.35)
  Top 0.152: v51.51,41.15 51.51,38.56 52.12,37.95 52.12,33.22 53.49,31.85 53.49,23.77 50.9,21.18 50.9,12.19 48.46,9.75 48.46,7.16 49.07,6.55 49.68,6.55 49.99,6.25 v49.99,4.42
  Bottom 0.152: v51.51,41.15 48.31,44.35 V3.12 | v49.99,4.42 48.01,2.44 48.01,2.13 47.4,1.52 37.8,1.52 36.88,2.44 X5.35
N$10  (via drill 0.35)
  Top 0.152: V3.13 45.72,41.15 v45.11,40.54 | v38.71,34.75 v42.22,38.25 | v37.8,33.83 37.8,29.57 34.29,26.06 34.29,9.6 v34.9,8.99
  Bottom 0.152: v45.11,40.54 44.5,40.54 v42.22,38.25 | v37.8,33.83 v38.71,34.75 | v34.9,8.99 35.36,8.99 36.73,7.62 X5.36
N$11  (via drill 0.35)
  Top 0.152: v23.47,25.76 21.95,27.28 21.95,37.64 8.84,50.75 5.18,50.75 RN2.5 | v36.12,10.21 36.12,8.38 35.81,8.08 35.81,6.55 31.85,2.59 X5.39
  Bottom 0.152: v23.47,25.76 23.47,15.24 28.5,10.21 v36.12,10.21
N$12
  Top 0.152: X5.38 33.53,7.62 29.57,11.58 29.57,14.78 21.64,22.71 21.64,37.49 10.97,48.16 5.18,48.16 RN2.4
N$13  (via drill 0.35)
  Top 0.152: v2.9,8.69 2.9,42.98 5.03,45.11 5.03,45.72 RN2.3
  Bottom 0.152: v2.9,8.69 2.9,7.77 7.01,3.66 33.22,3.66 34.29,2.59 X5.37
N$14  (via drill 0.35)
  Top 0.152: v7.77,1.98 1.52,8.23 1.52,59.44 3.96,61.87 6.1,61.87 6.71,61.27 6.71,58.06 5.18,56.54 5.18,55.93 RN2.7
  Bottom 0.152: v7.77,1.98 20.73,1.98 21.18,1.52 28.19,1.52 X5.41
N$15
  Top 0.152: RN2.8 5.03,58.37 5.03,57.76 3.5,56.24 3.5,47.85 4.72,46.63 9.91,46.63 19.36,37.19 19.36,33.53 21.34,31.55 21.34,22.55 26.06,17.83 26.06,10.67 29.11,7.62 X5.42
N$16
  Top 0.152: RN2.9 5.03,60.96 5.03,60.35 1.83,57.15 1.83,8.84 9.45,1.22 25.45,1.22 26.67,2.44 X5.43
N$17
  Top 0.152: X5.44 26.67,9.6 20.57,15.7 20.57,20.73 19.36,21.95 19.36,30.18 19.96,30.79 20.42,30.79 20.73,31.09 20.73,31.7 16.76,35.66 16.76,37.34 10.97,43.13 5.18,43.13 RN2.2
N$18  (via drill 0.35)
  Top 0.152: v27.28,47.09 25.6,48.77 25.6,51.36 21.03,55.93 21.03,65.08 21.49,65.53 21.49,65.99 U$2.32/A13 | v31.24,35.66 v31.24,40.08
  Bottom 0.152: v27.28,47.09 27.28,44.04 v31.24,40.08 | v31.24,35.66 31.24,35.2 39.32,27.13 39.32,26.67 X1.17
N$19
  Top 0.152: F1.1 41.91,74.98 54.56,74.98 55.93,76.35 76.5,76.35 77.88,74.98 X2.4
N$20
  Top 0.152: RN1.2 8.99,6.25 9.6,6.25 14.33,1.52 23.16,1.52 24.08,2.44 X5.45
N$21
  Top 0.152: RN1.3 11.43,6.4 12.04,6.4 14.33,8.69 23.01,8.69 24.08,7.62 X5.46
N$22
  Top 0.152: RN1.4 14.02,6.25 14.63,6.25 18.29,2.59 21.49,2.59 X5.47
N$23
  Top 0.152: RN1.5 16.61,6.4 20.27,6.4 21.49,7.62 X5.48
N$31  (via drill 0.35)
  Top 0.152: V2.3 15.24,32.31 v13.41,34.14 | v30.48,77.27 76.81,77.27 77.27,77.72 82.45,77.72 84.28,75.89 84.28,64.31 93.57,55.02 93.57,54.25 94.64,53.19 96.62,53.19 97.23,52.58 97.23,23.01 95.56,21.34 95.56,17.98 95.71,17.83 95.71,14.48 94.03,12.8 IC4.7
  Bottom 0.152: v13.41,34.14 11.12,36.42 11.12,41.6 5.49,47.24 4.12,47.24 2.9,48.46 2.9,58.22 4.72,60.05 13.26,60.05 v30.48,77.27
N$32  (via drill 0.35)
  Top 0.152: v7.32,49.23 4.72,49.23 v4.42,49.53 | v43.89,69.19 78.33,69.19 91.29,56.24 91.29,51.21 94.94,47.55 94.94,18.29 89.92,13.26 89.92,11.73 89.31,11.12 85.95,11.12 84.73,12.34 84.73,13.72 84.12,14.33 83.52,14.33 82.3,13.11 82.3,11.73 81.69,11.12 80.31,11.12 IC4.1
  Bottom 0.152: v7.32,49.23 18.75,37.8 18.75,35.81 17.83,34.9 17.83,29.26 V2.4 | v4.42,49.53 3.2,50.75 3.2,55.93 4.72,57.45 11.12,57.45 22.86,69.19 v43.89,69.19
N$33  (via drill 0.35)
  Top 0.152: v22.86,22.86 26.36,26.36 26.36,44.96 23.16,48.16 23.16,50.6 19.2,54.56 19.2,76.2 19.96,76.96 20.73,76.96 30.33,67.36 57.3,67.36 58.22,66.45 58.22,66.14 62.48,61.87 65.68,61.87 76.5,51.05 76.5,50.29 88.85,37.95 88.85,27.28 89.76,26.36 89.76,24.23 87.94,22.4 87.94,19.96 81.38,13.41 81.38,12.8 IC4.2
  Bottom 0.152: v22.86,22.86 22.86,26.67 V2.5
N$34  (via drill 0.35)
  Top 0.152: v30.18,64.16 33.53,64.16 33.83,64.47 59.44,64.47 69.19,54.71 72.39,54.71 76.2,50.9 76.2,49.68 88.54,37.34 88.54,25.15 v89.15,24.54 | v95.1,17.53 95.1,16.46 91.44,12.8 IC4.6
  Bottom 0.152: V2.6 22.86,34.9 23.77,35.81 23.77,39.62 19.96,43.43 19.96,53.95 v30.18,64.16 | v89.15,24.54 92.96,20.73 92.96,19.36 94.79,17.53 v95.1,17.53
N$35
  Bottom 0.152: IC3.7 19.05,17.83 17.83,19.05 17.83,27.28 19.05,28.5 19.05,35.51 20.27,36.73 V2.10
N$37
  Bottom 0.152: IC3.2 6.4,12.8 6.4,13.26 12.95,19.81 12.95,26.98 14.33,28.35 14.33,35.81 15.24,36.73 V2.12
N$38
  Top 0.152: V2.13 12.8,36.73 12.8,31.09 14.33,29.57 14.33,21.95 15.54,20.73 15.54,13.72 16.46,12.8 IC3.6
N$39  (via drill 0.35)
  Top 0.152: v45.11,10.82 45.11,11.28 44.81,11.58 44.81,13.72 v46.18,15.09 | v55.32,24.23 v54.1,23.01 | v70.41,26.82 74.07,26.82 74.52,26.36 78.49,26.36 80.01,27.89 V1.3
  Bottom 0.152: v45.11,10.82 43.28,12.65 IC2.7 | v54.1,23.01 v46.18,15.09 | v55.32,24.23 63.7,24.23 66.29,26.82 v70.41,26.82
N$40  (via drill 0.35)
  Top 0.152: v29.26,19.66 29.26,30.48 v35.51,36.73 | v37.49,38.71 37.49,46.63 40.39,49.53 v42.06,49.53 | v51.51,53.34 58.52,53.34 61.27,50.6 61.27,50.29 74.07,37.49 78.03,37.49 79.1,36.42 79.1,31.39 V1.4
  Bottom 0.152: v29.26,19.66 28.04,18.44 28.04,12.8 IC2.1 | v37.49,38.71 v35.51,36.73 | v42.06,49.53 43.43,50.9 43.43,51.21 45.57,53.34 v51.51,53.34
N$41
  Top 0.152: IC2.2 30.48,12.65 31.09,12.65 32.61,11.12 33.38,11.12 33.98,11.73 33.98,33.83 36.42,36.27 36.42,44.65 30.79,50.29 30.79,54.25 33.98,57.45 55.63,57.45 56.39,58.22 57,58.22 63.7,51.51 63.7,50.44 76.35,37.8 79.7,37.8 81.53,35.97 81.53,31.55 85.04,28.04 V1.5
N$42
  Bottom 0.152: V1.6 87.63,29.41 83.52,33.53 83.52,54.71 78.64,59.59 78.64,66.29 75.13,69.8 46.79,69.8 43.43,66.45 43.43,66.14 42.37,65.08 34.44,65.08 20.57,51.21 20.57,48.46 30.02,39.01 30.02,34.29 42.06,22.25 43.28,22.25 44.2,21.34 44.2,17.07 40.69,13.56 40.69,12.8 IC2.6
N$43
  Top 0.152: IC1.7 69.8,12.8 69.8,14.02 69.19,14.63 69.19,15.24 72.69,18.75 75.13,18.75 82.45,26.06 85.19,26.06 86.11,26.98 86.11,34.59 85.19,35.51 V1.10
N$44  (via drill 0.35)
  Top 0.152: v63.86,22.71 60.05,22.71 58.67,21.34 58.67,19.81 54.71,15.85 54.71,12.8 IC1.1
  Bottom 0.152: v63.86,22.71 67.06,25.91 74.83,25.91 76.5,27.58 76.5,29.57 82.45,35.51 V1.11
N$45
  Bottom 0.152: IC1.2 57.15,14.63 61.27,18.75 61.27,21.34 66.14,26.21 70.71,26.21 80.01,35.51 V1.12
N$46
  Top 0.152: V1.13 66.29,24.38 66.29,17.98 67.21,17.07 67.21,12.8 IC1.6
N$47
  Bottom 0.152: V2.11 16.76,35.81 16.76,28.8 15.54,27.58 15.54,19.96 14.33,18.75 12.95,18.75 7.92,13.72 7.92,12.34 6.71,11.12 5.94,11.12 4.42,12.65 3.81,12.65 IC3.1
N$56
  Top 0.152: V3.3 48.16,36.73 48.16,34.44 45.87,32.16 45.87,22.4 44.2,20.73 44.2,8.84 43.43,8.08 43.43,3.5 44.35,2.59 X5.29
R/W'
  Bottom 0.152: U$2.15/A1 52.12,50.75 52.12,38.41 52.43,38.1 52.43,32.92 53.49,31.85 53.49,28.5 54.56,27.43 54.56,26.67 X1.5
REG_SEL
  Top 0.152: U$2.16/A2 54.71,50.75 54.71,34.29 57.15,31.85 X1.4
RST  (via drill 0.35)
  Top 0.152: v22.55,64.16 28.5,64.16 29.41,65.08 52.58,65.08 v53.34,65.84 | V1.9 87.63,36.42 v78.03,46.02
  Bottom 0.152: V2.9 22.86,38.41 16.15,45.11 16.15,57.76 v22.55,64.16 | v53.34,65.84 53.34,66.14 54.86,67.67 64.01,67.67 64.77,66.9 U$2.5 64.77,65.99 63.86,65.08 61.72,65.08 56.08,59.44 56.08,50.44 55.93,50.29 55.93,46.02 | 55.93,46.02 55.93,44.5 V3.9 | 55.93,46.02 v78.03,46.02
RXD
  Top 0.152: U$1.RXD 83.06,49.53 70.1,62.48 70.1,62.79 67.36,65.53 67.36,65.99 U$2.4/CANRX
S1
  Bottom 0.152: V1.1 74.98,28.04 74.98,28.5 81.23,34.75 81.23,53.49 81.38,53.65 81.38,56.39 77.57,60.2 77.57,65.99 U$2.0/RX
S2  (via drill 0.35)
  Top 0.152: v44.65,68.58 72.39,68.58 U$2.1/TX
  Bottom 0.152: v44.65,68.58 22.71,68.58 8.99,54.86 4.57,54.86 3.5,53.8 3.5,52.88 3.96,52.43 5.49,52.43 6.71,51.21 6.71,48.92 14.02,41.6 14.02,28.5 13.11,27.58 12.34,27.58 10.82,29.11 10.21,29.11 V2.1
S3  (via drill 0.35)
  Top 0.152: v42.52,48.46 41.91,47.85 41.91,43.28 43.13,42.06 43.13,36.88 V3.1 | v56.69,57.61 v53.03,53.95
  Bottom 0.152: v42.52,48.46 43.59,48.46 46.02,50.9 46.02,51.21 47.55,52.73 51.82,52.73 v53.03,53.95 | v56.69,57.61 56.69,59.59 61.87,64.77 71.17,64.77 72.39,65.99 U$2.2
TXD
  Top 0.152: U$2.3/CANTX 69.95,65.99 71.02,65.99 73.15,63.86 80.62,63.86 87.33,57.15 U$1.TXD